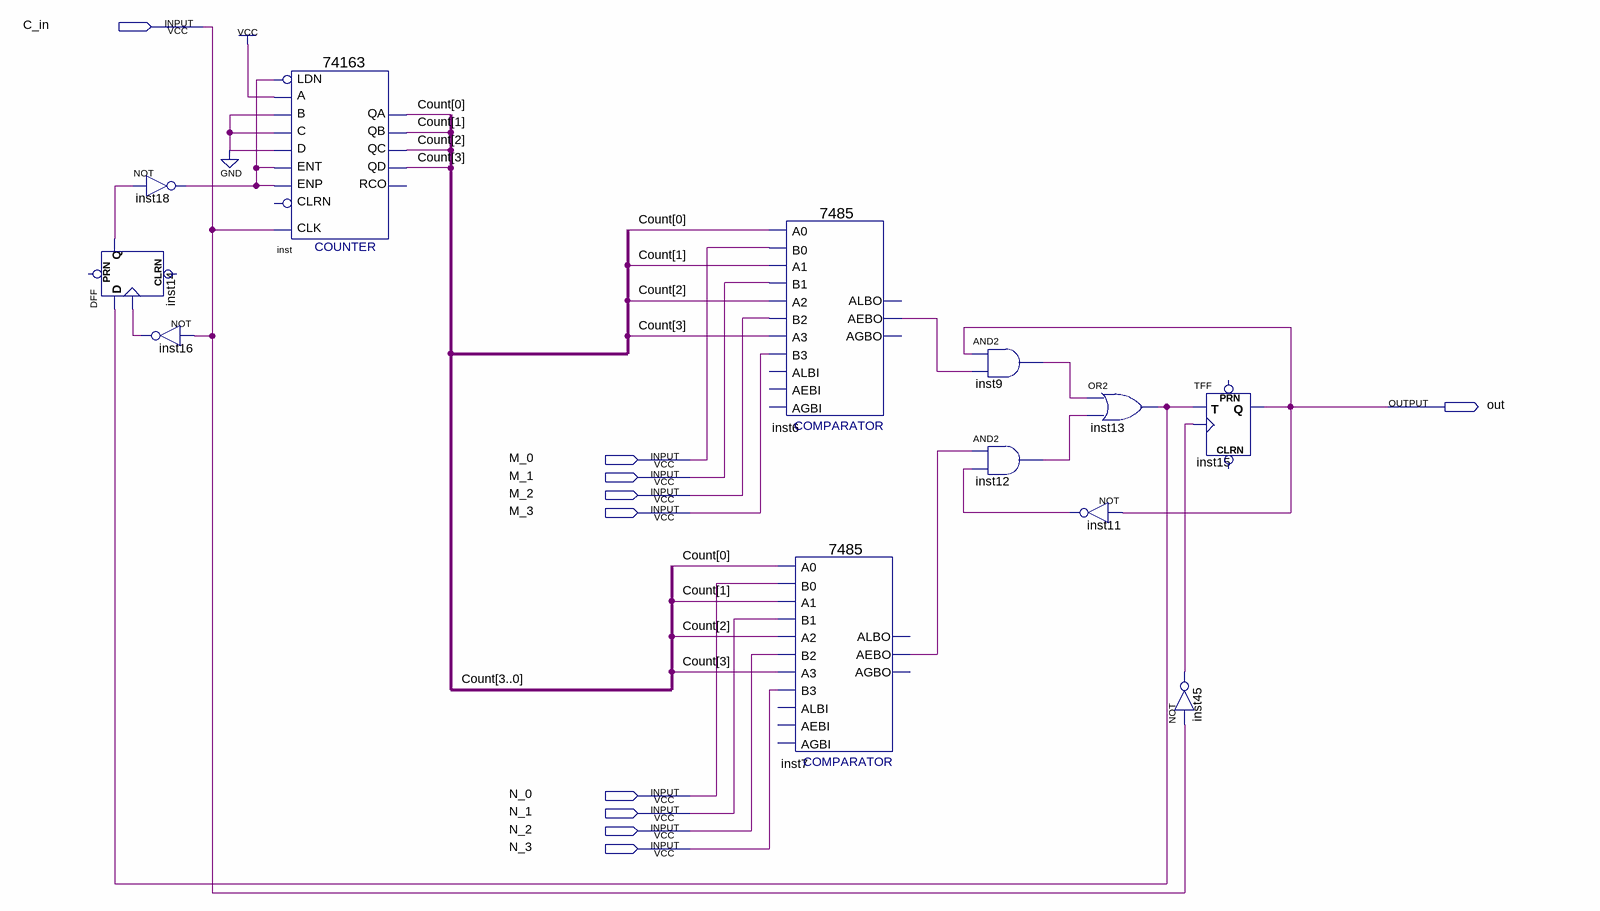
[diagram p0: schematic sheet]
// Quartus schematic MNBlock.bdf as structural Verilog: 12 symbols, 10 pins
module MNBlock (
  input  C_in,
  input  M_0,
  input  M_1,
  input  M_2,
  input  M_3,
  input  N_0,
  input  N_1,
  input  N_2,
  input  N_3,
  output out
);

  wire inst6_aebo, inst7_aebo, inst9_out, inst11_out, inst12_out, inst13_out, inst14_q, inst16_out,
       inst18_out, inst45_out;
  wire [3:0] Count;

  DFF inst14 (.CLK(inst16_out), .D(inst13_out), .Q(inst14_q));  // open: CLRN, PRN
  not inst18 (inst18_out, inst14_q);
  not inst16 (inst16_out, C_in);
  \74163  inst (
    .C(1'b0), .B(1'b0), .A(1'b1), .ENT(inst18_out), .D(1'b0), .CLK(C_in), .ENP(inst18_out), .LDN(inst18_out),
    .QA(Count[0]), .QB(Count[1]), .QC(Count[2]), .QD(Count[3]));  // open: CLRN, RCO
  \7485  inst6 (
    .A3(Count[3]), .B2(M_2), .A2(Count[2]), .A0(Count[0]), .B0(M_0), .B3(M_3), .A1(Count[1]), .B1(M_1),
    .AEBO(inst6_aebo));  // open: AEBI, AGBI, ALBI, ALBO, AGBO
  \7485  inst7 (
    .A3(Count[3]), .B2(N_2), .A2(Count[2]), .A0(Count[0]), .B0(N_0), .B3(N_3), .A1(Count[1]), .B1(N_1),
    .AEBO(inst7_aebo));  // open: AEBI, AGBI, ALBI, ALBO, AGBO
  and inst9 (inst9_out, out, inst6_aebo);
  and inst12 (inst12_out, inst7_aebo, inst11_out);
  or inst13 (inst13_out, inst9_out, inst12_out);
  not inst11 (inst11_out, out);
  not inst45 (inst45_out, C_in);
  TFF inst15 (.T(inst13_out), .CLK(inst45_out), .Q(out));  // open: PRN, CLRN
endmodule
